# Altium schematic sheet ADC.SchDoc
size A4; SheetNumber: 4; SheetTotal: 7
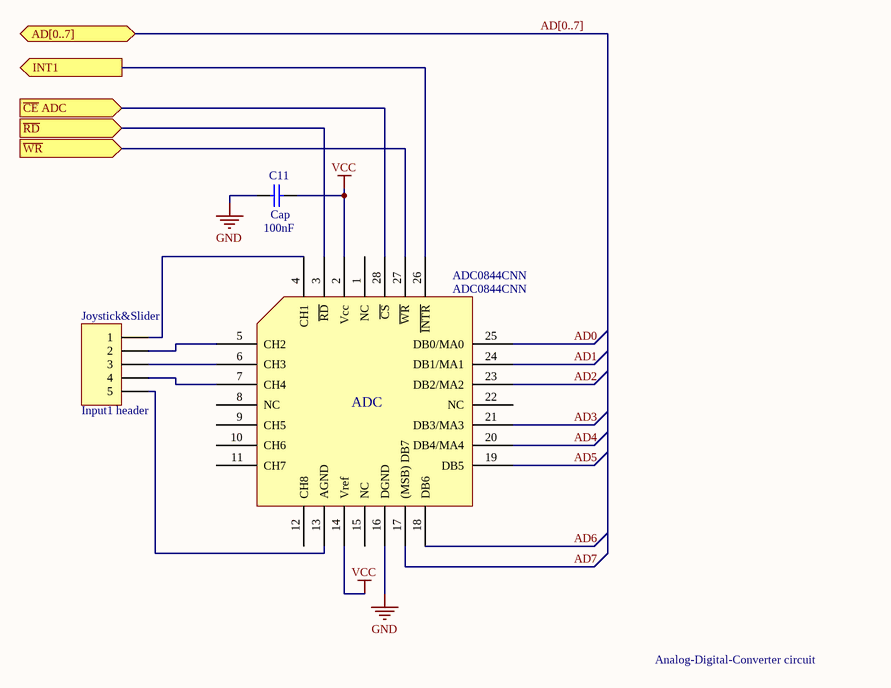
[diagram p0: ADC.SchDoc]

## Parts
ADC0844CNN  ADC0844CNN  [ADC0844CNN PLCC 28-PIN]
C11  Cap  value 100nF  [C1210]
Joystick&Slider  Input1 header  [HDR1X5]

## Ports
AD[0..7] (bidir), INT1 (out), ~{CE} ADC (in), ~{RD} (in), ~{WR} (in)

## Nets
GND: ADC0844CNN.16(DGND) C11.2
VCC: ADC0844CNN.2(Vcc) ADC0844CNN.14(Vref) C11.1
AD0: ADC0844CNN.25(DB0/MA0)
AD1: ADC0844CNN.24(DB1/MA1)
AD2: ADC0844CNN.23(DB2/MA2)
AD3: ADC0844CNN.21(DB3/MA3)
AD4: ADC0844CNN.20(DB4/MA4)
AD5: ADC0844CNN.19(DB5)
AD6: ADC0844CNN.18(DB6)
AD7: ADC0844CNN.17((MSB)_DB7)
~{CE} ADC: ADC0844CNN.28(~{CS}) ; port ~{CE} ADC
INT1: ADC0844CNN.26(~{INTR}) ; port INT1
~{RD}: ADC0844CNN.3(~{RD}) ; port ~{RD}
~{WR}: ADC0844CNN.27(~{WR}) ; port ~{WR}
NetADC0844CNN_4: ADC0844CNN.4(CH1) Joystick&Slider.1
NetADC0844CNN_5: ADC0844CNN.5(CH2) Joystick&Slider.2
NetADC0844CNN_6: ADC0844CNN.6(CH3) Joystick&Slider.3
NetADC0844CNN_7: ADC0844CNN.7(CH4) Joystick&Slider.4
NetADC0844CNN_13: ADC0844CNN.13(AGND) Joystick&Slider.5

Not connected (* = marked no-connect by the designer): ADC0844CNN 1(NC) 8(NC) 9(CH5) 10(CH6) 11(CH7) 12(CH8) 15(NC) 22(NC)

## Buses and harness runs
bus AD[0..7] = port AD[0..7]

## Notes on the sheet
- Analog-Digital-Converter circuit
- Title:
- Course:
- TTK4155 Industrielle og innbygde datasystemers kontruksjon
- Size:
- Date:
- Author:
- A4
- Moltumyr, Andreas Hanssen
- Number:
- Time:
- Revision:
- Sheet
- of
- File:
- (in symbol ADC0844CNN) ADC

## Library data of the parts
ADC0844CNN = ADC0844CNN: ADC - Analogue to Digital Converter
C11 = Cap Semi: Capacitor (Semiconductor SIM Model); Published: 8-Jun-2000; LatestRevisionDate: 29-May-2009; LatestRevisionNote: IPC-7351 Footprint Added.; PackageReference: C1206; Publisher: Altium Limited; PackageDescription: Chip Capacitor
Joystick&Slider = Header 5: Header, 5-Pin; LatestRevisionDate: 17-Jul-2002; LatestRevisionNote: Re-released for DXP Platform.; Publisher: Altium Limited